# EAGLE design Callisto_RJ45_Generic_Load (EAGLE 9.6.2)
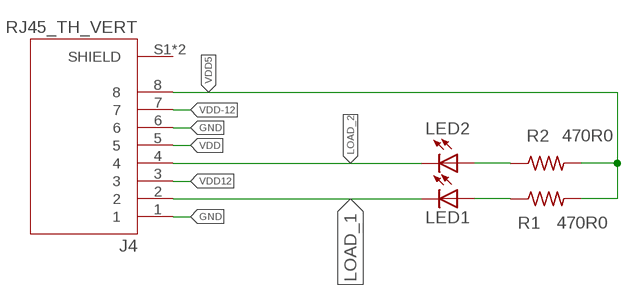
[diagram p0: schematic, sheet 1]

## Parts
J4  RJ45_TH_VERT  [ASSMANN_A-2014-2S-4-N-R]
LED1  Green  LED_0805_GREEN  [0805]
LED2  Green  LED_0805_GREEN  [0805]
R1  470R0  R_0402_470R0  [0402]
R2  470R0  R_0402_470R0  [0402]

## Nets
GND: J4.1 J4.6
LOAD_1: J4.2 LED1.2(C)
LOAD_2: J4.4 LED2.2(C)
N$1: LED2.1(A) R2.P$1
N$2: LED1.1(A) R1.P$1
VDD: J4.5
VDD5: J4.8 R1.P$2 R2.P$2
VDD12: J4.3
VDD-12: J4.7
Unconnected: J4.S1(SHIELD) J4.S2(SHIELD)

## Library data of the parts
J4 = 3D_MIG_Controller:RJ45_TH_VERT: Jack Modular Connector 8p8c (RJ45, Ethernet) Vertical Shielded; DESCRIPTION: Jack Modular Connector 8p8c (RJ45, Ethernet) Vertical Shielded; DIGI-KEY_PART_NUMBER: AE10399-ND; MF: Assmann WSW Components; MP: A-2014-2S-4-N-R; PACKAGE: None
LED1 LED2 = 3D_MIG_Controller:LED_0805_GREEN: Green 570nm LED Indication - Discrete 2.2V 0805 (2012 Metric); PARTNO: LG R971-KN-1
R1 R2 = 3D_MIG_Controller:R_0402_470R0; PARTNO: RMCF0402JT470R

## Board
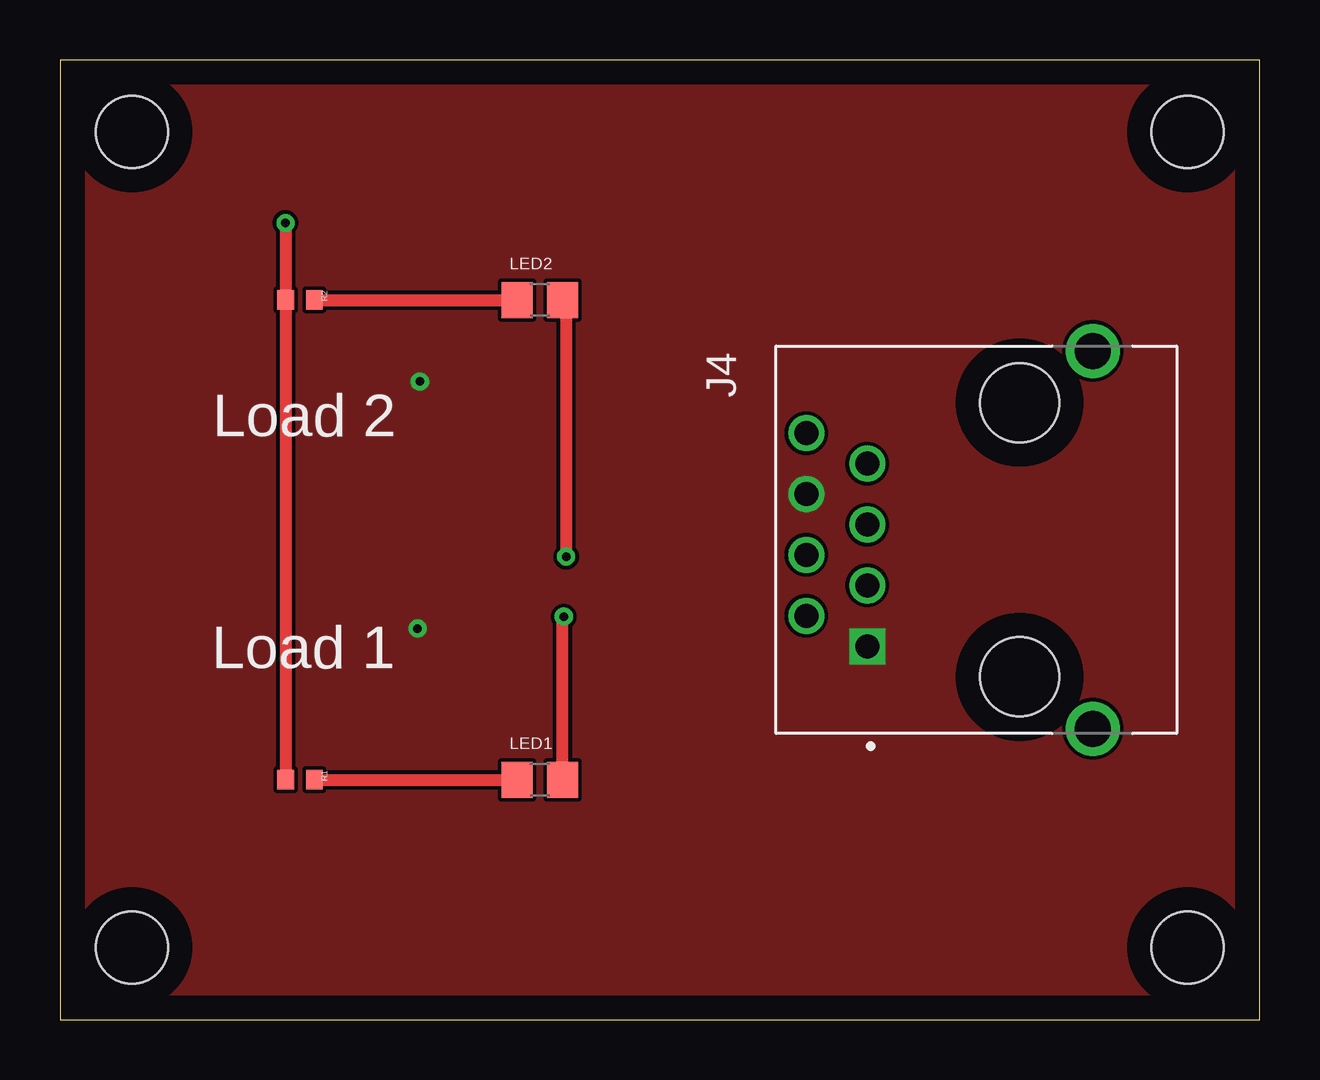
[diagram p1: board, top side]
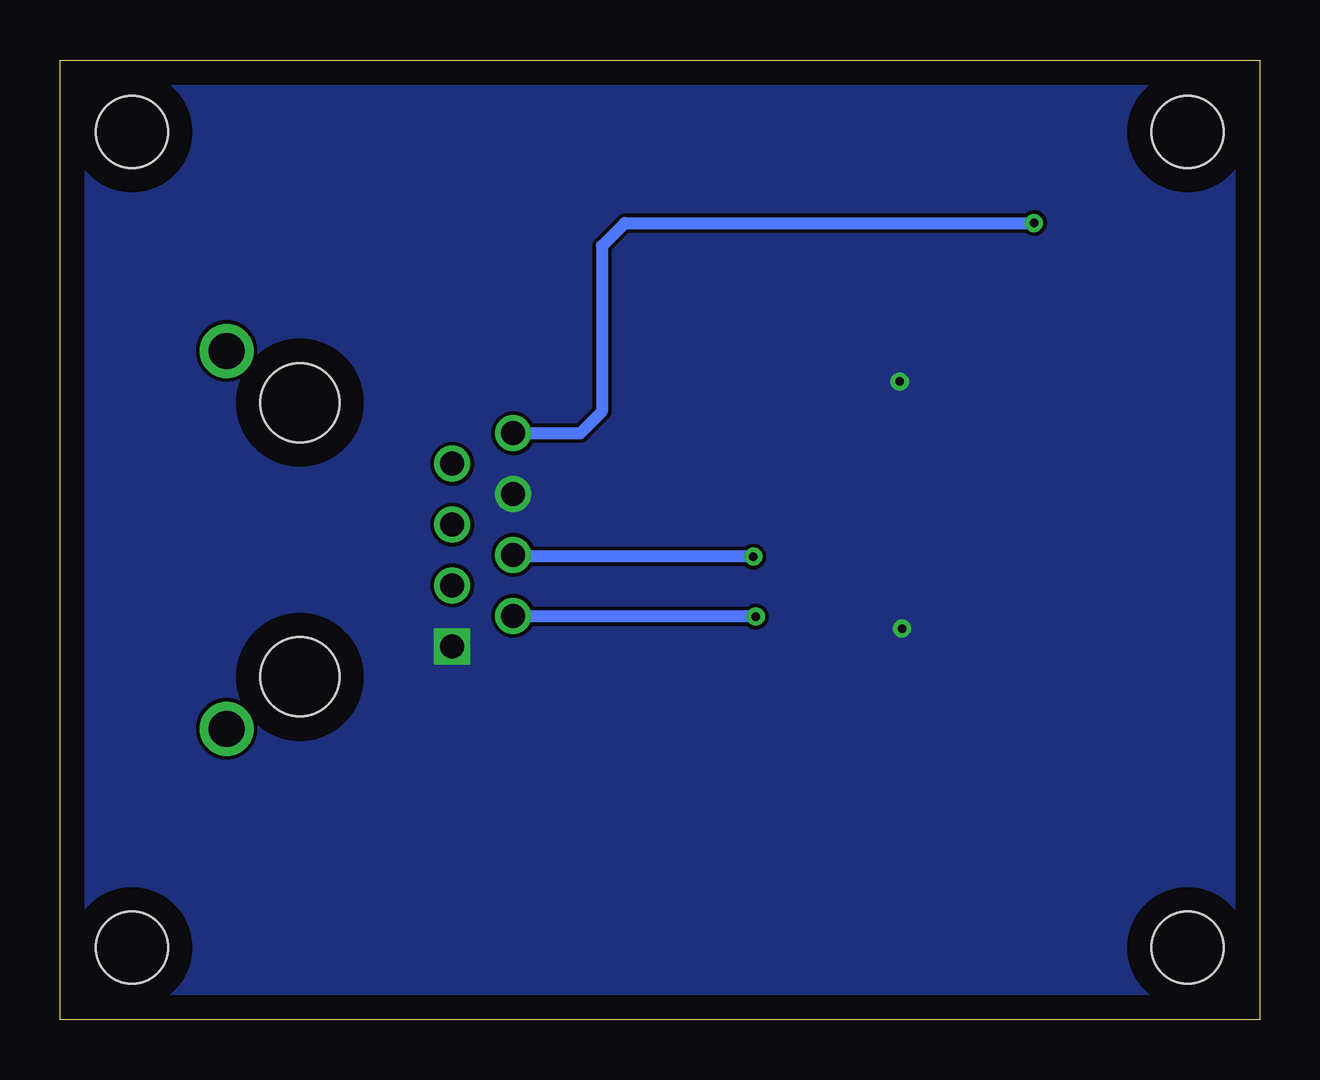
[diagram p2: board, bottom side, seen from below]

Size 50 x 40 mm. Coordinates in mm from the lower left corner, seen from the top.
Outline: 0,0 50,0 50,40 0,40 0,0
Copper layers (1*16): Top 0.035mm / dielectric 1.5mm / Bottom 0.035mm
Design rules "default": minimum track width 6mil, minimum drill 0.35mm, track to track 6mil, track to pad 6mil, pad to pad 6mil, via to via 6mil, smd to smd 6mil, copper to edge 40mil, drill to drill 6mil, minimum pad ring 10mil, minimum via ring 8mil, stop-mask expansion 4mil, vias tented up to drill 0mil, thermal gap 10mil
Holes 3 mm at 3,3 47,3 3,37 47,37

### Footprints (pad centres in the part's own frame; a part is rotated, then mirrored left to right if it is on the bottom)
ASSMANN_A-2014-2S-4-N-R = drill 1 square: 1 4.445,-6.35 | drill 1: 2 3.175,-8.89; 3 1.905,-6.35; 4 0.635,-8.89; 5 -0.635,-6.35; 6 -1.905,-8.89; 7 -3.175,-6.35; 8 -4.445,-8.89 | drill 1.5: S1 -7.875,3.05; S2 7.875,3.05 | hole 3.3: -5.715,0; 5.715,0
0805 = smd 1.3 x 1.5: 1 -0.95,0; 2 0.95,0
0402 = smd 0.8 x 0.7: P$1 0,0.6; P$2 0,-0.6

### Placement (x,y rotation side)
J4  40,20 270 top
LED1  20,10 0 top
LED2  20,30 0 top
R1  10,10 270 top
R2  10,30 270 top

### Tracks (layer width: path | path; a pad name or v marks a point on that pad's centre or on a via)
GND  (via drill 0.35)
  other vias: 15,26.6 14.9,16.3
  pour Bottom (no thermals): 0,40 50,40 50,0 0,0
  pour Top (no thermals): 0,40 50,40 50,0 0,0
LOAD_1  (via drill 0.35)
  Top 0.508: LED1.2 20.95,16.75 v21,16.8
  Bottom 0.508: v21,16.8 31.09,16.8 J4.2
LOAD_2  (via drill 0.35)
  Top 0.508: LED2.2 21.1,29.85 v21.1,19.3
  Bottom 0.508: v21.1,19.3 31.05,19.3 J4.4
N$1
  Top 0.508: R2.P$1 LED2.1
N$2
  Top 0.508: R1.P$1 LED1.1
VDD5  (via drill 0.35)
  Top 0.508: v9.4,33.2 R2.P$2 R1.P$2
  Bottom 0.508: J4.8 28.31,24.45 27.41,25.34 27.41,32.24 26.45,33.2 v9.4,33.2

### Text on the board
tPlace: Load 2 | Load 1